# Altium schematic sheet TU_MCU.SchDoc
size 500 x 500 mm
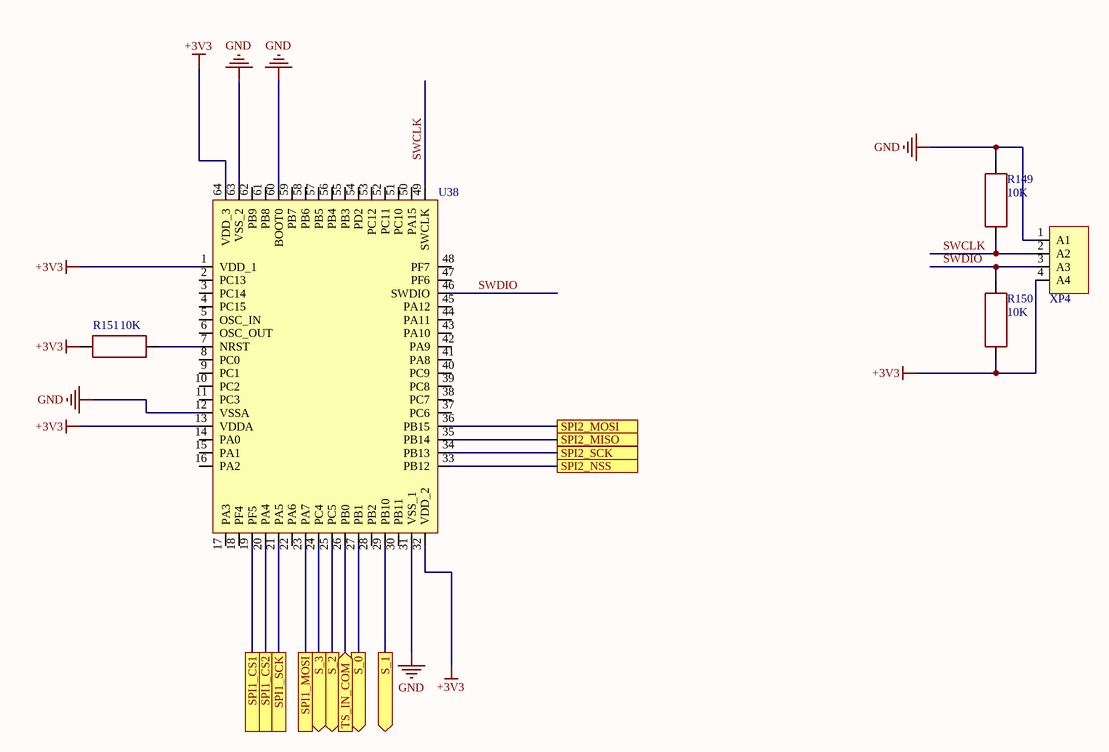
[diagram p0: TU_MCU.SchDoc]

## Parts
R149  value 10K  [RES: 0603]  (hidden comment: Resistor_0603)
R150  value 10K  [RES: 0603]  (hidden comment: Resistor_0603)
R151  value 10K  [RES: 0603]  (hidden comment: Resistor_0603)
U38  STM32F030R8T6TR  [LQFP-64]  (value not drawn)
XP4  PLS-6 (DS1021-1x6)  [PLS-4 (DS1021-1x4)]  (value not drawn)

## Ports
S_0 (out), S_1 (out), S_2 (out), S_3 (out), SPI1_CS1, SPI1_CS2, SPI1_MOSI, SPI1_SCK, SPI2_MISO, SPI2_MOSI, SPI2_NSS, SPI2_SCK, TS_IN_COM (in)

## Nets
+3V3: R150.2 R151.1 U38.1(VDD_1) U38.13(VDDA) U38.32(VDD_2) U38.64(VDD_3) XP4.4(A4)
GND: R149.1 U38.12(VSSA) U38.31(VSS_1) U38.60(BOOT0) U38.63(VSS_2) XP4.1(A1)
S_0: U38.27(PB1) ; port S_0
S_1: U38.29(PB10) ; port S_1
S_2: U38.25(PC5) ; port S_2
S_3: U38.24(PC4) ; port S_3
SPI1_CS1: U38.19(PF5) ; port SPI1_CS1
SPI1_CS2: U38.20(PA4) ; port SPI1_CS2
SPI1_MOSI: U38.23(PA7) ; port SPI1_MOSI
SPI1_SCK: U38.21(PA5) ; port SPI1_SCK
SPI2_MISO: U38.35(PB14) ; port SPI2_MISO
SPI2_MOSI: U38.36(PB15) ; port SPI2_MOSI
SPI2_NSS: U38.33(PB12) ; port SPI2_NSS
SPI2_SCK: U38.34(PB13) ; port SPI2_SCK
SWCLK: R149.2 U38.49(SWCLK) XP4.2(A2)
SWDIO: R150.1 U38.46(SWDIO) XP4.3(A3)
TS_IN_COM: U38.26(PB0) ; port TS_IN_COM
NetR151_2: R151.2 U38.7(NRST)

Not connected (* = marked no-connect by the designer): U38 2(PC13) 3(PC14) 4(PC15) 5(OSC_IN) 6(OSC_OUT) 8(PC0) 9(PC1) 10(PC2) 11(PC3) 14(PA0) 15(PA1) 16(PA2) 17(PA3) 18(PF4) 22(PA6) 28(PB2) 30(PB11) 37(PC6) 38(PC7) 39(PC8) 40(PC9) 41(PA8) 42(PA9) 43(PA10) 44(PA11) 45(PA12) 47(PF6) 48(PF7) 50(PA15) 51(PC10) 52(PC11) 53(PC12) 54(PD2) 55(PB3) 56(PB4) 57(PB5) 58(PB6) 59(PB7) 61(PB8) 62(PB9)

## Library data of the parts
R149-R151 = Resistor_0603: Power: 0.1W; Tolerance: ±1%; Package/Case: 0603; Temperature: -55...+125°C; Product Category: Resistors
U38 = STM32F030R8T6TR: MCU Mainstream Arm Cortex-M0 Value line MCU 64 Kbytes of Flash , 48 MHz CPU; Manufacturer: STMicroelectronics; Datasheet: https://www.st.com/resource/en/datasheet/stm32f030r8.pdf; HelpURL: https://eu.mouser.com/ProductDetail/STMicroelectronics/STM32F030R8T6TR?qs=s5SkPsIz10%252B%252B1w15QiyTpQ%3D%3D; Package/Case: LQFP-64; Product Category: Microcontrollers
XP4 = PLS-4 (DS1021-1x4): Board to Board, Surface Mount, Single row, 6 Positions, 2.54mm, Vertical.; Manufacturer: Connfly; Datasheet: https://static.chipdip.ru/lib/977/DOC005977245.pdf; HelpURL: https://www.chipdip.by/product/pls-4; Product Category: Connectors